# Altium schematic sheet USB_PD.SchDoc
size A4; SheetNumber: 2; SheetTotal: 4
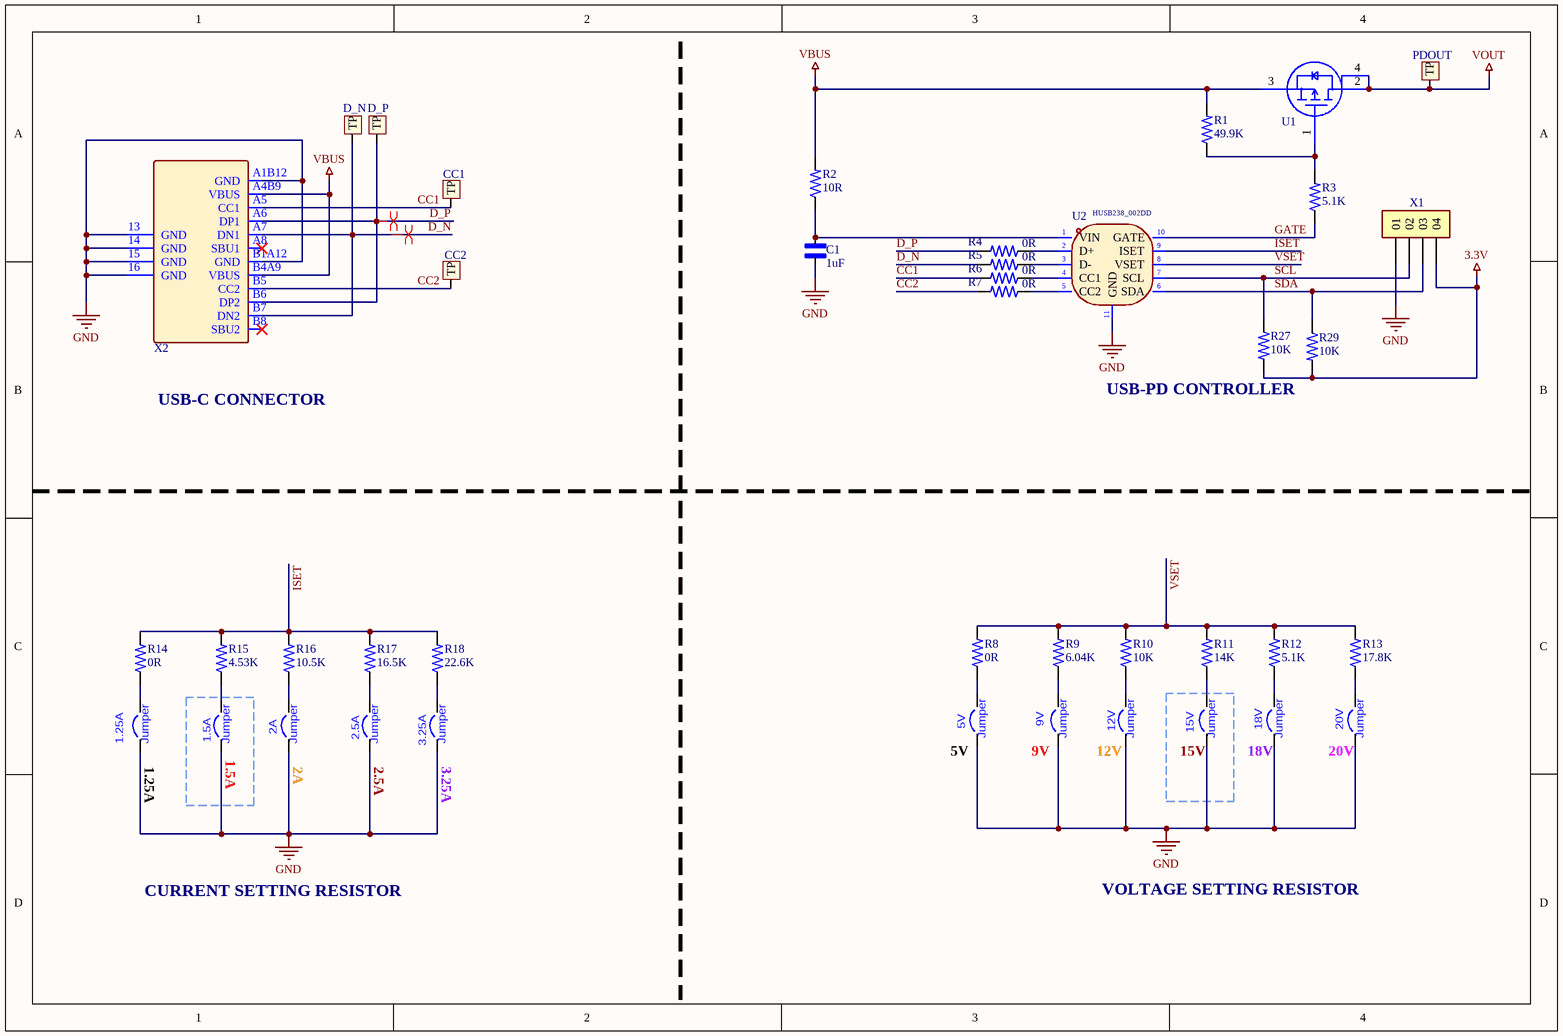
[diagram p0: USB_PD.SchDoc]

## Parts
1.5A  Jumper  [PAD-JUMPER-2-NC_BY_PASTE_YES_SILK]
1.25A  Jumper  [PAD-JUMPER-2-NC_BY_PASTE_YES_SILK]
2.5A  Jumper  [PAD-JUMPER-2-NC_BY_PASTE_YES_SILK]
2A  Jumper  [PAD-JUMPER-2-NC_BY_PASTE_YES_SILK]
3.25A  Jumper  [PAD-JUMPER-2-NC_BY_PASTE_YES_SILK]
5V  Jumper  [PAD-JUMPER-2-NC_BY_PASTE_YES_SILK]
9V  Jumper  [PAD-JUMPER-2-NC_BY_PASTE_YES_SILK]
12V  Jumper  [PAD-JUMPER-2-NC_BY_PASTE_YES_SILK]
15V  Jumper  [PAD-JUMPER-2-NC_BY_PASTE_YES_SILK]
18V  Jumper  [PAD-JUMPER-2-NC_BY_PASTE_YES_SILK]
20V  Jumper  [PAD-JUMPER-2-NC_BY_PASTE_YES_SILK]
C1  value 1uF  [CAP 0402]  (hidden comment: SMD capacitor)
CC1  TEST POINT  [TESTPOINT]  (value not drawn)
CC2  TEST POINT  [TESTPOINT]  (value not drawn)
D_N  TEST POINT  [TESTPOINT]  (value not drawn)
D_P  TEST POINT  [TESTPOINT]  (value not drawn)
PDOUT  TEST POINT  [TESTPOINT]  (value not drawn)
R1  value 49.9K  [RES_0603]  (hidden comment: SMD resistor)
R2  value 10R  [RES_0603]  (hidden comment: SMD resistor)
R3  value 5.1K  [RES_0603]  (hidden comment: SMD resistor)
R4  value 0R  [RES 0402]  (hidden comment: SMD resistor)
R5  value 0R  [RES 0402]  (hidden comment: SMD resistor)
R6  value 0R  [RES 0402]  (hidden comment: SMD resistor)
R7  value 0R  [RES 0402]  (hidden comment: SMD resistor)
R8  value 0R  [RES 0402]  (hidden comment: SMD resistor)
R9  value 6.04K  [RES 0402]  (hidden comment: SMD resistor)
R10  value 10K  [RES 0402]  (hidden comment: SMD resistor)
R11  value 14K  [RES 0402]  (hidden comment: SMD resistor)
R12  value 5.1K  [RES 0402]  (hidden comment: SMD resistor)
R13  value 17.8K  [RES 0402]  (hidden comment: SMD resistor)
R14  value 0R  [RES 0402]  (hidden comment: SMD resistor)
R15  value 4.53K  [RES 0402]  (hidden comment: SMD resistor)
R16  value 10.5K  [RES 0402]  (hidden comment: SMD resistor)
R17  value 16.5K  [RES 0402]  (hidden comment: SMD resistor)
R18  value 22.6K  [RES 0402]  (hidden comment: SMD resistor)
R27  value 10K  [RES 0402]  (hidden comment: SMD resistor NC)
R29  value 10K  [RES 0402]  (hidden comment: SMD resistor NC)
U1  P-Channel  MOSFET  [SOT-223-4_L6.5-W3.5-P2.30-LS7.0-BR]  (value not drawn)
U2  value HUSB238_002DD  [DFN-10]  (hidden comment: USB-PD-IC)
X1  Header X 5  [SAMTEC_TS-104-T-A]  (value not drawn)
X2  USB-C connector  [USB-C-SMD_TYPEC-304J-BCP16]  (value not drawn)

## Blocks framed on the sheet
1.5A: 1.5A
15V: 15V

## Nets
3.3V: R27.2 R29.2 X1.04
GND: 1.5A.1 1.25A.1 2.5A.1 2A.1 3.25A.1 5V.1 9V.1 12V.1 15V.1 18V.1 20V.1 C1.2 U2.11(GND) X1.01 X2.13(GND) X2.14(GND) X2.15(GND) X2.16(GND) X2.A1B12(GND) X2.B1A12(GND)
VBUS: R1.2 R2.2 U1.3(S) X2.A4B9(VBUS) X2.B4A9(VBUS)
VOUT: PDOUT.1(TP) U1.2(D) U1.4(D)
CC1: CC1.1(TP) R6.2 X2.A5(CC1)
CC2: CC2.1(TP) R7.2 X2.B5(CC2)
D_N: D_N.1(TP) R5.2 X2.A7(DN1) X2.B7(DN2)
D_P: D_P.1(TP) R4.2 X2.A6(DP1) X2.B6(DP2)
GATE: R3.1 U2.10(GATE)
ISET: R14.2 R15.2 R16.2 R17.2 R18.2 U2.9(ISET)
SCL: R27.1 U2.7(SCL) X1.02
SDA: R29.1 U2.6(SDA) X1.03
VSET: R8.2 R9.2 R10.2 R11.2 R12.2 R13.2 U2.8(VSET)
Net1.5A_2: 1.5A.2 R15.1
Net1.25A_2: 1.25A.2 R14.1
Net2.5A_2: 2.5A.2 R17.1
Net2A_2: 2A.2 R16.1
Net3.25A_2: 3.25A.2 R18.1
Net5V_2: 5V.2 R8.1
Net9V_2: 9V.2 R9.1
Net12V_2: 12V.2 R10.1
Net15V_2: 15V.2 R11.1
Net18V_2: 18V.2 R12.1
Net20V_2: 20V.2 R13.1
NetC1_1: C1.1 R2.1 U2.1(VIN)
NetR1_1: R1.1 R3.2 U1.1(G)
NetR4_1: R4.1 U2.2(D+)
NetR5_1: R5.1 U2.3(D-)
NetR6_1: R6.1 U2.4(CC1)
NetR7_1: R7.1 U2.5(CC2)

Not connected (* = marked no-connect by the designer): X2 A8(SBU1)* B8(SBU2)*

## Layout directives
differential pair; differential pair class USB: D_N, D_P

## Notes on the sheet
- USB-C CONNECTOR
- (near R27) USB-PD CONTROLLER
- (near 1.25A) 1.25A
- (near 2A) 2A
- (near 2.5A) 2.5A
- (near 3.25A) 3.25A
- (near 5V) 5V
- (near 9V) 9V
- (near 12V) 12V
- (near 18V) 18V
- (near 20V) 20V
- CURRENT SETTING RESISTOR
- VOLTAGE SETTING RESISTOR

## Library data of the parts
1.5A 1.25A 2.5A 2A 3.25A 5V 9V 12V 15V 18V 20V = JUMPER SOLDER BRIDGE: SMD JUMPER
C1 = CAP_SMD_CERAMIC: Voltage: 50V; Tolerance: ±10%; Package: 0603; Price: *; JLCPCB Part #: *
R1-R18 R27 R29 = RES_SMD_CERAMIC: Tolerance: ±5%; Price: *; JLCPCB Part #: *
  R1-R3: Package: 0603
  R4-R18 R27 R29: Package: 0402
U1 = DMP6023LE-13: 60V 7A 2W 35mΩ@4.5V,4A 3V@250uA 1 P-Channel SOT-223 MOSFETs ROHS; Manifacturing Company Name: DIODES; Manifacturing Part Number: DMP6023LE-13; Data Sheet: https://www.lcsc.com/datasheet/C154901.pdf; Package: SOT-223; Price: *; Tolerance: N/A; JLCPCB Part #: C154901
U2 = USB_PD_HUSB238: DFN-10L(3x3) USB Converters ROHS; Manifacturing Company Name: Hynetek; Manifacturing Part Number: HUSB238_002DD; Data Sheet: https://www.lcsc.com/datasheet/C7471904.pdf; Package: DFN-10L(3x3); Price: *; Tolerance: N/A; JLCPCB Part #: C7471904
X1 = 4 Pin Header: 4 pin header pitch 2.54mm; Manifacturing Part Number: C91552; Manifacturing Company Name: BOOMELE(Boom Precision Elec); Data Sheet: https://datasheet.lcsc.com/lcsc/2304140030_BOOMELE-Boom-Precision-Elec-C91552_C91552.pdf; Package: THT P 2.54mm; Price: *; Tolerance: N/A; JLCPCB Part #: C91552
X2 = TYPEC-304J-BCP16: 5A USB 3.1 1 Surface Mount, Right Angle 16P Female -40℃~+85℃ Type-C SMD USB Connectors ROHS; Manifacturing Company Name: XUNPU; Manifacturing Part Number: TYPEC-304J-BCP16; Data Sheet: https://www.lcsc.com/datasheet/C2835315.pdf; Package: SMD; Price: *; Tolerance: N/A; JLCPCB Part #: C2835315